# EasyEDA Pro project 手柄PCB工程.epro

# Board PCB1_1
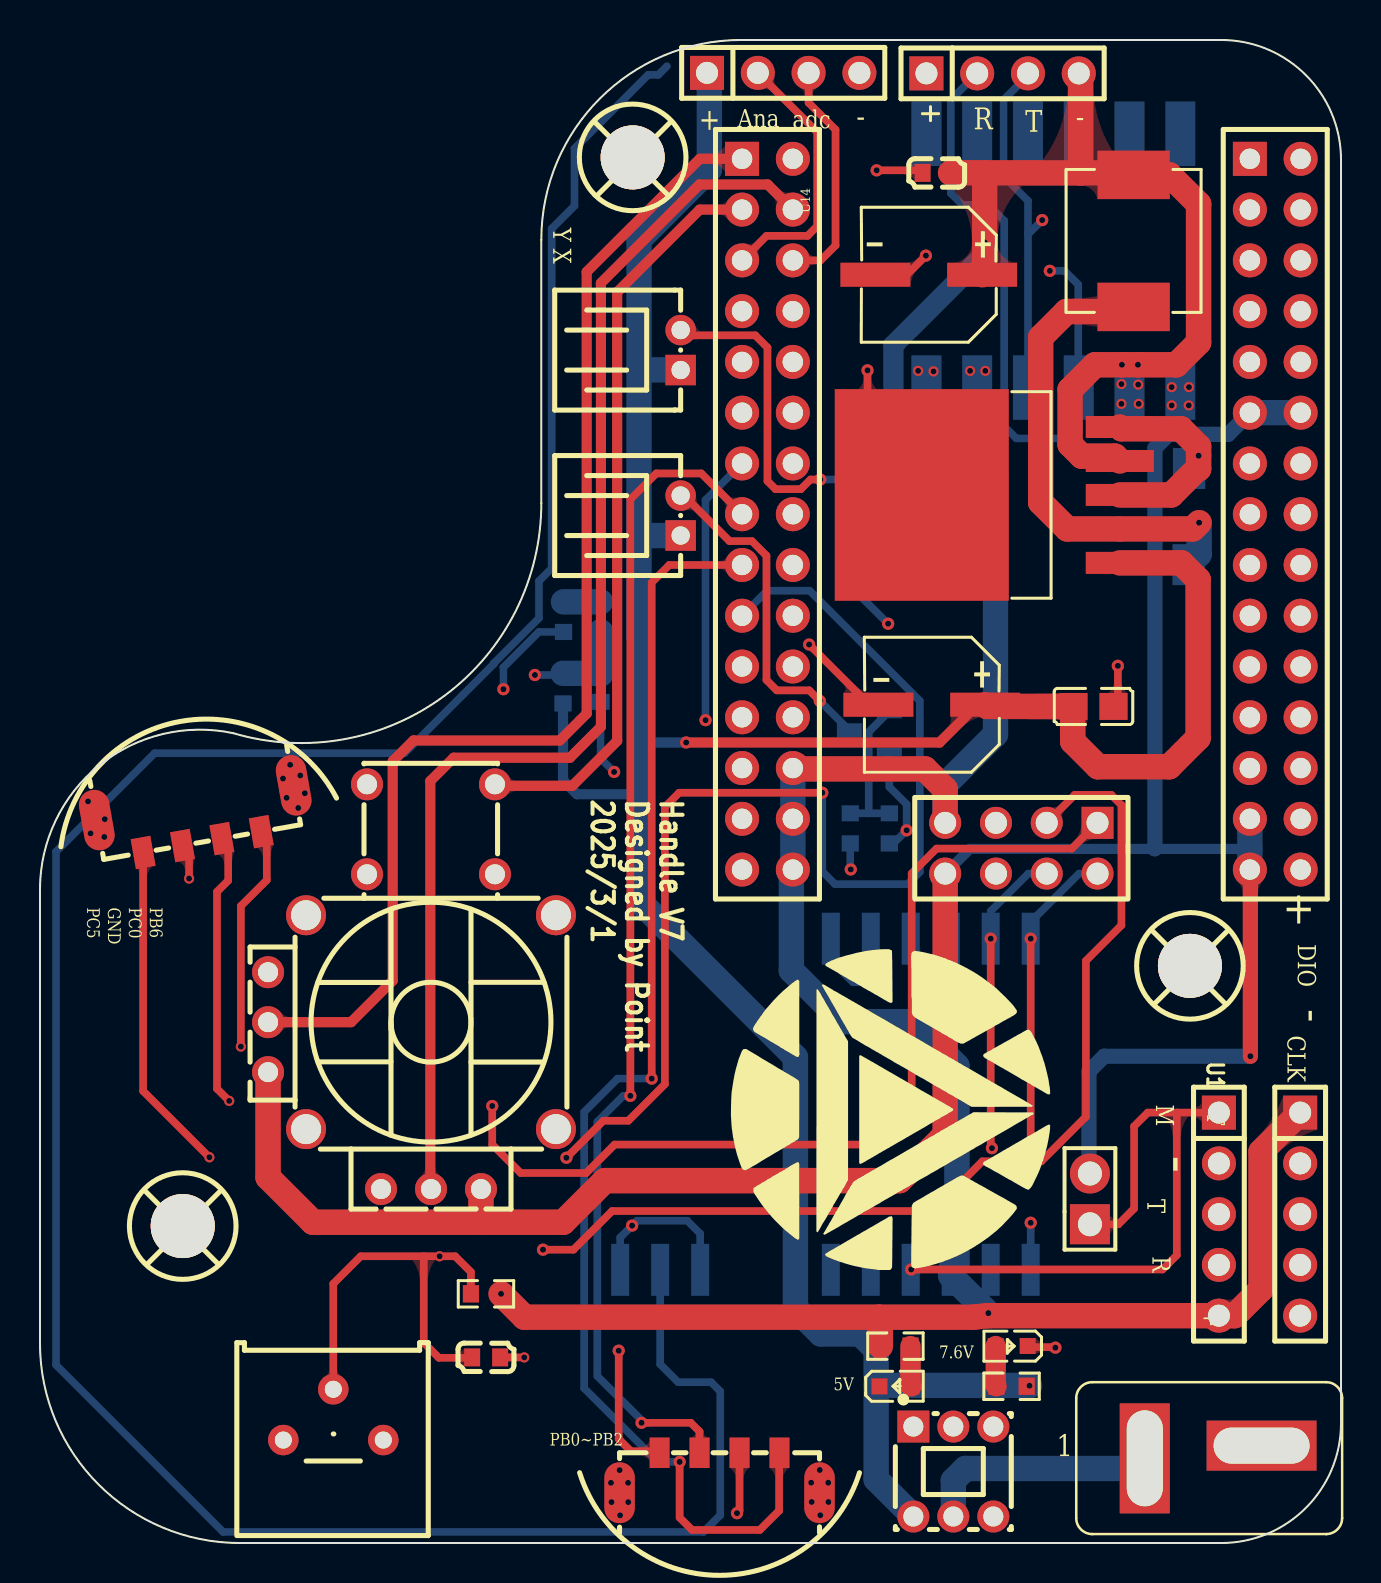
[diagram p0: board, top side]
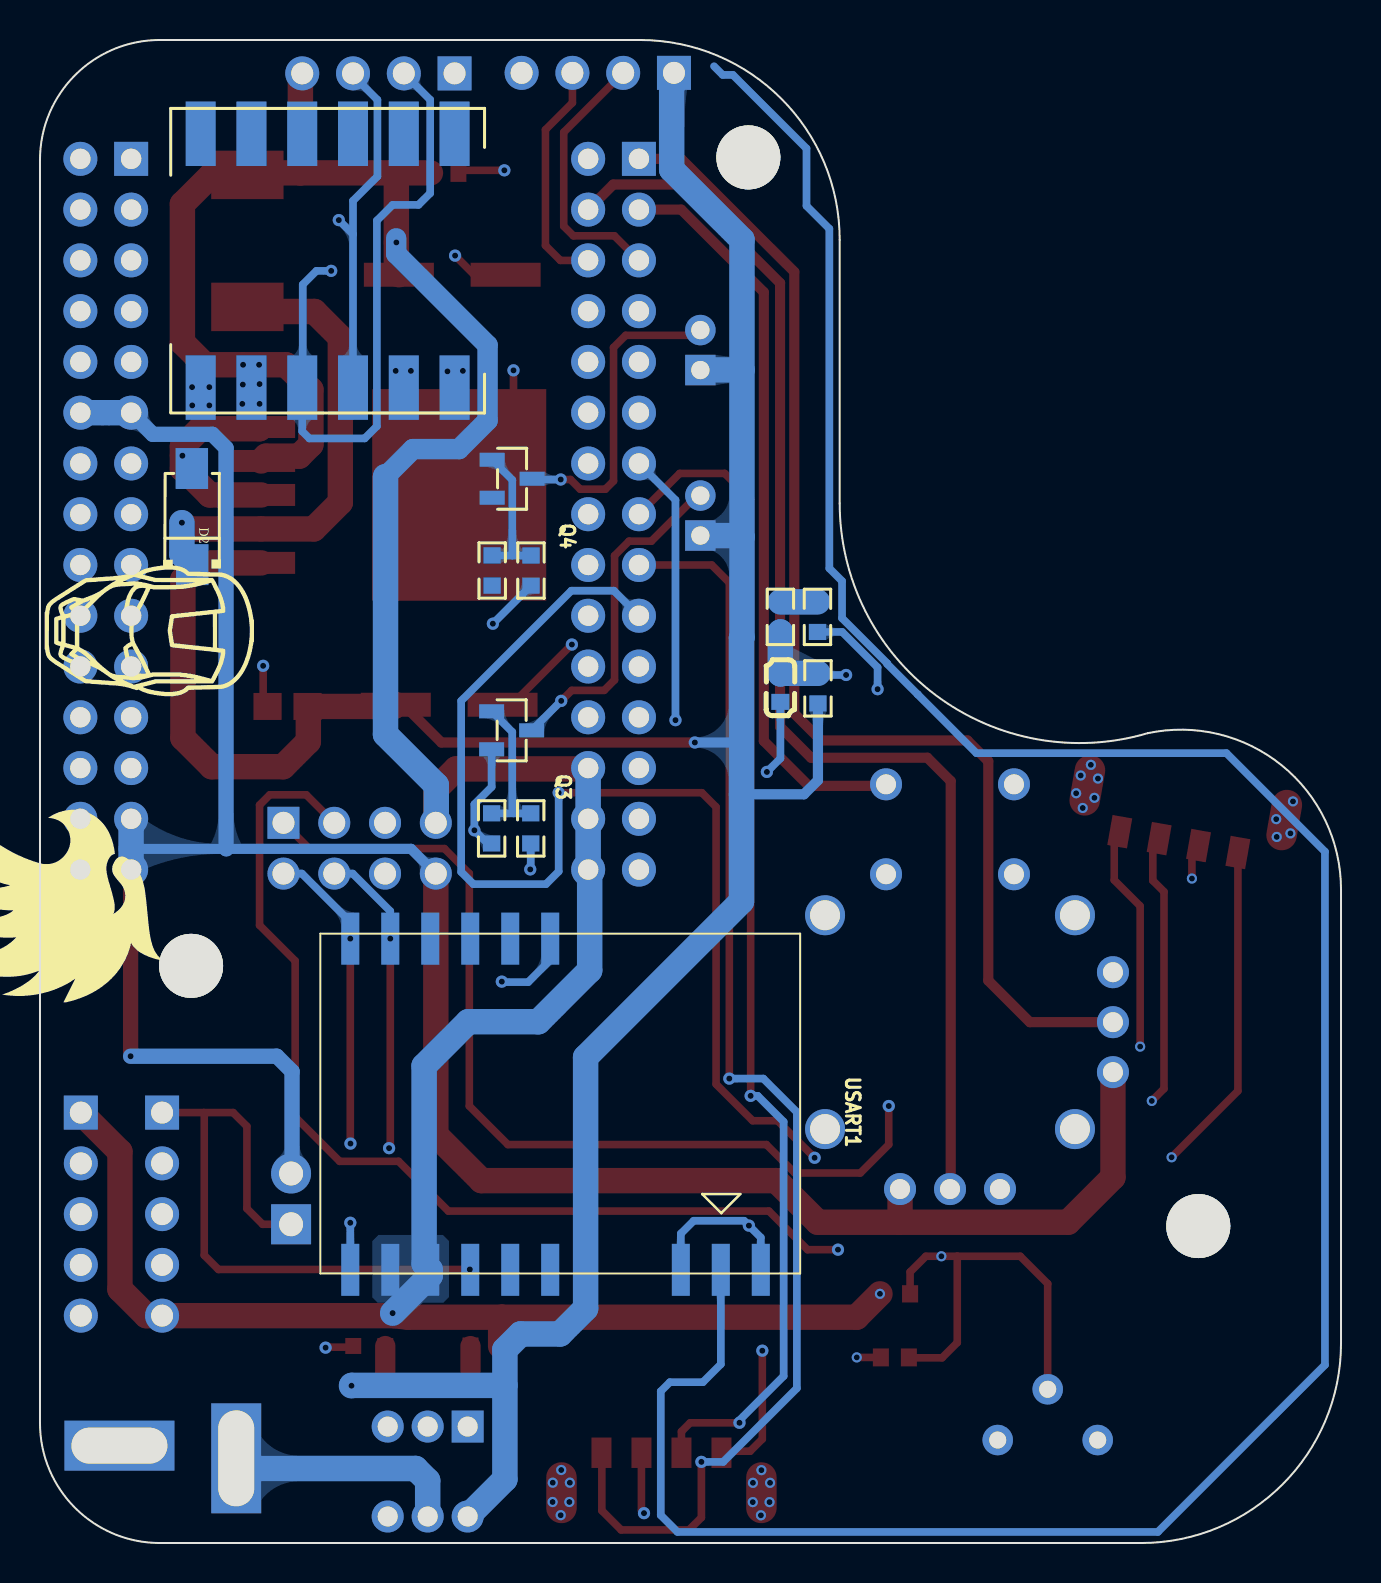
[diagram p1: board, bottom side, seen from below]

Outline 65.08 x 75.2 mm; copper layers: Top Layer, Inner1, Inner2, Bottom Layer. Coordinates in mm from the lower left corner of the outline.
Outline path: 0,32.69 arc(2.97,38.91) 9.67,40.52 arc(20.26,42.41) 25.08,52.02 25.08,65.2 arc(28,72.27) 35.08,75.2 59.08,75.2 arc(63.32,73.44) 65.08,69.2 65.08,6 arc(63.32,1.76) 59.08,0 10,0 arc(2.93,2.93) 0,10 0,32.69
Stack: Top Layer 0.035mm 外层铜厚1oz / Dielectric1 0.2104mm 7628 RC49% 8.6mil / Inner1 0.0152mm 内层铜厚 / Dielectric2 1.065mm 1.1mm H/HOZ 含铜 / Inner2 0.0152mm 内层铜厚 / Dielectric3 0.2104mm 7628 RC49% 8.6mil / Bottom Layer 0.035mm 外层铜厚1oz

## Design rules (mm)
template: JLCPCB Capability(Two Layers Board)
spacing copperThickness1oz (default): track to track 0.102, other pairs 0.152 to 0.3
spacing copperThickness2oz: track to track 0.203, other pairs 0.152 to 0.3
track width copperThickness1oz (default): min 0.127, default 0.254, max 2.54
track width copperThickness2oz: min 0.203, default 0.254, max 2.54
differential pair differentialPair (default): width min 0.127, default 0.254, max 2.54; gap min 0.152, default 0.152
via viaSize (default): diameter min 0.5, default 0.61, max 10; hole min 0.3, default 0.305, max 6.3

## Placement (name value [footprint] x y rotation side)
C23  220uF  [CAP-SMD_BD6.3-L6.6-W6.6-FD]  44.46 63.45 180 top
C24  100nF  [C0603]  44.85 68.55 180 top
C26  100nF  [C0805]  52.7 41.85 180 top
C27  220uF  [CAP-SMD_BD6.3-L6.6-W6.6-LS7.6-RD]  44.61 41.94 180 top
C28  100nF  [C0603]  28.04 42.78 270 bottom
C29  100nF  [C0603]  22.32 9.29 0 top
D2  SS54  [SMA_L4.3-W2.6-LS5.0-RD]  57.47 51.35 90 bottom
H38  -  [T插公头]  57.8 4.24 270 top
H50  USART1  [HDR-TH_8P-P2.54-V-F-R2-C4-S2.54]  49.09 34.76 180 top
H56  KH-2.54PH180-1X5P-L11.5  [HDR-TH_5P-P2.54-V-M]  58.97 16.45 270 top
H57  PZ254V-11-05P  [HDR-TH_5P-P2.54-V-M]  63.03 16.45 270 top
H58  PZ254V-11-02P  [HDR-TH_2P-P2.54-V-M]  52.52 17.22 90 top
H60  PZ254V-11-04P  [HDR-TH_4P-P2.54-V-M]  48.15 73.53 0 top
L4  33uH  [IND-SMD_L7.0-W6.6_FXL0630]  54.7 65.15 90 top
LED2  -  [LED_0603]  42.84 7.84 0 top
LED4  -  [LED_0603]  48.55 9.85 180 top
Q3  AO3400  [SOT-23-3_L2.9-W1.3-P1.90-LS2.4-BR]  41.48 40.66 0 bottom
Q4  AO3400  [SOT-23-3_L2.9-W1.3-P1.90-LS2.4-BR]  41.46 53.25 0 bottom
R7  2K  [R0603]  42.79 9.85 0 top
R10  100kΩ  [R0603]  26.16 42.76 90 bottom
R11  75kΩ  [R0603]  28.04 46.33 90 bottom
R12  2kΩ  [R0603]  26.19 46.33 270 bottom
R15  1kΩ  [R0603]  40.52 48.65 90 bottom
R16  10kΩ  [R0603]  42.46 48.66 90 bottom
R17  1kΩ  [R0603]  40.53 35.75 90 bottom
R18  10kΩ  [R0603]  42.48 35.75 90 bottom
R21  1kΩ  [R0603]  48.6 7.84 180 top
R24  5.1kΩ  [R0603]  22.31 12.47 180 top
R25  10kΩ  [RES-ADJ-TH_3P-L9.5-W9.5-P2.50-L_3386P]  14.67 6.42 180 top
RJ1  高巨摇杆电位器3D13A1N-T-386  [RES-ADJ-TH_3D13A1N-T-386]  18.61 27.83 270 top
SCREW1  -  [M3螺丝]  29.71 69.26 0 top
SCREW2  -  [M3螺丝]  7.2 15.79 0 top
SCREW3  -  [M3螺丝]  57.58 28.81 0 top
SW1  TK-6580D-1  [SW-TH_TK-6580D-1]  45.68 3.58 90 top
U8  LM2596S-5.0/TR  [TO-263-5_L10.2-W8.6-P1.70-LS14.4-TL]  49.06 52.44 180 top
U14  左  [HDR-TH_30P-P2.54-V-F-R2-C15-S2.54-2]  36.39 51.47 270 top
U15  右  [HDR-TH_30P-P2.54-V-F-R2-C15-S2.54-2]  61.79 51.47 270 top
U23  WAFER-PH2.0-2PWZ  [CONN-TH_2P-P2.00_GP01-2001WR-2P]  32.05 51.41 90 top
U24  WAFER-PH2.0-2PWZ  [CONN-TH_2P-P2.00_GP01-2001WR-2P]  32.05 59.69 90 top
U26  -  [四PinU型按键]  34.99 4.52 180 top
U27  JY901S  [jy901s]  50.69 64.16 90 bottom
U28  -  [四PinU型按键]  7.13 34.9 10 top
USART1  -  [ATK-LORA]  40.55 21.66 180 bottom
USART3  PZ254V-11-04P  [HDR-TH_4P-P2.54-V-M]  37.18 73.55 0 top

## Footprints (pads in the part's own frame, mm; a bottom-side part is the same pattern mirrored in y, then rotated)
ATK-LORA
  rect 0.9x2.6 smd: 1(11.532,-7.992) 2(9.532,-7.992) 3(7.532,-7.992) 4(0.999,-7.992) 5(-1.001,-7.992) 6(-3.001,-7.992) 7(-5.001,-7.992) 8(-7.001,-7.992) 9(-9.001,-7.992) 10(-9.001,8.576) 11(-7.001,8.576) 12(-5.001,8.576) 13(-3.001,8.576) 14(-1.001,8.576) 15(0.999,8.576)
C0603
  rect 0.8x0.9 smd: 1(-0.7,0) 2(0.7,0)
C0805
  rect 1.41x1.35 smd: 1(-1,0) 2(1,0)
CAP-SMD_BD6.3-L6.6-W6.6-FD
  rect 3.5x1.2 smd: 1(-2.67,0) 2(2.67,0)
CAP-SMD_BD6.3-L6.6-W6.6-LS7.6-RD
  rect 3.5x1.2 smd: 1(-2.67,0) 2(2.67,0)
CONN-TH_2P-P2.00_GP01-2001WR-2P
  rect 1.524x1.524 hole 0.914: 1(-1,0)
  round 1.524 hole 0.914: 2(1,0)
HDR-TH_2P-P2.54-V-M
  rect 2x2 hole 1.2: 1(-1.27,0)
  round 2 hole 1.2: 2(1.27,0)
HDR-TH_4P-P2.54-V-M
  rect 1.7x1.7 hole 1.1: 1(-3.81,0)
  round 1.7 hole 1.1: 2(-1.27,0) 3(1.27,0) 4(3.81,0)
HDR-TH_5P-P2.54-V-M
  rect 1.7x1.7 hole 1.1: 1(-5.08,0)
  round 1.7 hole 1.1: 2(-2.54,0) 3(0,0) 4(2.54,0) 5(5.08,0)
HDR-TH_8P-P2.54-V-F-R2-C4-S2.54
  rect 1.6x1.6 hole 1.1: 1(-3.81,-1.27)
  round 1.6 hole 1.1: 2(-3.81,1.27) 3(-1.27,-1.27) 4(-1.27,1.27) 5(1.27,-1.27) 6(1.27,1.27) 7(3.81,-1.27) 8(3.81,1.27)
HDR-TH_30P-P2.54-V-F-R2-C15-S2.54-2
  rect 1.7x1.7 hole 1.02: 1(-17.78,-1.27)
  round 1.7 hole 1.02: 2(-17.78,1.27) 3(-15.24,-1.27) 4(-15.24,1.27) 5(-12.7,-1.27) 6(-12.7,1.27) 7(-10.16,-1.27) 8(-10.16,1.27) 9(-7.62,-1.27) 10(-7.62,1.27) 11(-5.08,-1.27) 12(-5.08,1.27) 13(-2.54,-1.27) 14(-2.54,1.27) 15(0,-1.27) 16(0,1.27) 17(2.54,-1.27) 18(2.54,1.27) 19(5.08,-1.27) 20(5.08,1.27) 21(7.62,-1.27) 22(7.62,1.27) 23(10.16,-1.27) 24(10.16,1.27) 25(12.7,-1.27) 26(12.7,1.27) 27(15.24,-1.27) 28(15.24,1.27) 29(17.78,-1.27) 30(17.78,1.27)
IND-SMD_L7.0-W6.6_FXL0630
  rect 2.424x3.62 smd: 1(3.302,0) 2(-3.302,0)
jy901s
  rect 3.224x1.501 smd: 1(-6.35,6.35) 2(-6.35,3.81) 3(-6.35,1.27) 4(-6.35,-1.27) 5(-6.35,-3.81) 6(-6.35,-6.35) 7(6.35,-6.35) 8(6.35,-3.81) 9(6.35,-1.27) 10(6.35,1.27) 11(6.35,3.81) 12(6.35,6.35)
LED_0603
  rect 0.8x0.8 smd: 1(-0.851,-0.01) 2(0.75,-0.005)
M3螺丝
  round 3.2 hole 3.2: 1(-0.064,0.064)
R0603
  rect 0.806x0.864 smd: 1(-0.753,0) 2(0.753,0)
RES-ADJ-TH_3D13A1N-T-386
  round 2 hole 1.5: 0(-3.575,7.2) 0(-3.575,-5.3) 0(7.125,7.2) 0(7.125,-5.3)
  round 1.6 hole 1: 1(10.125,3.45) 2(10.125,0.95) 3(10.125,-1.55) 4(4.275,-7.2) 5(1.775,-7.2) 6(-0.725,-7.2) 7(-10.125,4.15) 8(-10.125,-2.25) 9(-5.625,4.15) 10(-5.625,-2.25)
RES-ADJ-TH_3P-L9.5-W9.5-P2.50-L_3386P
  round 1.524 hole 0.85: 1(-2.5,1.27) 2(0,-1.27) 3(2.5,1.27)
SMA_L4.3-W2.6-LS5.0-RD
  rect 2.046x1.62 smd: 1(-2.404,-0.009) 2(2.404,0.009)
SOT-23-3_L2.9-W1.3-P1.90-LS2.4-BR
  rect 1.25x0.7 smd: 1(1,-0.95) 2(1,0.95) 3(-1,0)
SW-TH_TK-6580D-1
  rect 1.6x1.6 hole 1: 1(2.25,2)
  round 1.6 hole 1: 2(2.25,0) 3(2.25,-2) 4(-2.25,2) 5(-2.25,0) 6(-2.25,-2)
TO-263-5_L10.2-W8.6-P1.70-LS14.4-TL
  rect 3.4x1.1 smd: 1(-4.953,3.4) 2(-4.953,1.7) 3(-4.953,0) 4(-4.953,-1.7) 5(-4.953,-3.4)
  rect 8.705x10.587 smd: 6(4.953,0)
T插公头
  rect 2.5x5.5 hole 1.8x4.8: 1(-0.635,3.302)
  rect 5.5x2.5 hole 4.8x1.8: 2(0,-2.54)
四PinU型按键
  rect 1x1.524 smd: 1(-2,0) 2(0,0) 3(2,0) 4(4,0)
  oval 1.524x3.048 smd: 5(-4,2) 6(6,2)

## Nets
3V3: H50.8 H58.2 RJ1.1 RJ1.4 U15.11 U15.12 U15.27 U15.29
5V: C23.1 C24.1 H50.7 H56.5 H57.1 H60.4 L4.1 R7.1 R24.1 U8.4 U14.26 U14.28 U14.30 U27.2 USART1.7 USART1.8
7.6V: C26.2 C27.1 R10.1 R21.1 SW1.4 U8.1 U23.1 U24.1 USART3.1
+7.6V: H38.2 SW1.5
GND: C23.2 C24.2 C26.1 C27.2 C28.2 C29.2 H38.1 H50.5 H56.2 H57.4 H60.1 LED2.1 LED4.1 Q3.2 Q4.2 R12.2 R16.1 R18.1 R25.3 RJ1.3 RJ1.6 RJ1.9 U8.6 U14.25 U14.27 U14.29 U15.13 U15.14 U15.26 U15.28 U15.30 U26.2 U27.5 U28.2 USART1.1 USART1.3 USART1.9 USART1.15 USART3.4
BAT: U15.25
BOOT: U15.3
CLK: H50.1 H57.5
DIO: H50.3 H57.3
MDO: H56.1 H58.1 USART1.6
PA0: U14.6 USART3.3
PA1: U14.5 USART3.2
PA2: H60.2 U14.8 U27.3
PA3: H60.3 U14.7 U27.4
PA4: U14.10
PA5: U14.12
PA6: U14.14
PA7: U14.16
PA8: U15.17
PA11: U15.20
PA12: U15.19
PA15: U15.18
PB0: U14.13 U26.4
PB1: U14.15 U26.3
PB2: U14.17 U26.1
PB3: U15.8
PB4: U15.7
PB5: U15.6
PB6: U15.5 U28.4
PB7: U15.4
PB9: U15.2
PB10: U14.19
PB11: C29.1 R24.2 R25.2 U14.20
PB12: C28.1 R10.2 R11.1 U14.21
PB13: U14.22
PB14: U14.23
PB15: U14.24
PC0: U14.2 U28.3
PC1: RJ1.5 U14.1
PC2: RJ1.2 U14.4
PC3: RJ1.7 U14.3
PC4: U14.18
PC5: U14.11 U28.1
PC6: U15.23
PC7: U15.24
PC8: R15.1 U15.21
PC9: R17.1 U15.22
PC10: U15.16
PC11: U15.15
PC12: U15.10
PC13: U15.1
PD2: U15.9
RST: H50.6
RX_PA10: H50.4 H56.4 USART1.11
TX_PA9: H50.2 H56.3 USART1.10
VREF: U14.9
$1N385: D2.2 U8.3 U8.5
$1N386: D2.1 L4.2 U8.2
$1N392: LED2.2 R7.2
$1N13221: R11.2 R12.1
$1N31586: Q4.1 R15.2 R16.2
$1N32984: Q3.1 R17.2 R18.2
$1N36354: LED4.2 R21.2
$1N39133: Q3.3 U23.2
$1N39187: Q4.3 U24.2

Pads without a net: H57 2; R25 1; RJ1 0 8 10; SCREW1 1; SCREW2 1; SCREW3 1; SW1 1 2 3 6; U26 5 6; U27 1 6 7 8 9 10 11 12; U28 5 6; USART1 2 4 5 12 13 14

## Via types
v1: diameter 0.508, hole 0.3, Top Layer to Bottom Layer, 45 vias
v2: diameter 0.61, hole 0.305, Top Layer to Bottom Layer, 40 vias

## Routing (per net, layer and track width the routed paths; a pad name or vN(x,y) marks a point on that pad's centre or on a via; arc(x,y) is an arc through that point)
3V3: length 125.9
  Top Layer w0.762: v2(60.54,24.35) 60.54,33.67 U15.29
  Top Layer w1.27: RJ1.1 22.06,16.09 22.1,16.05 ; 22.1,16.05 26.17,16.05 28.25,18.13 42.99,18.13 45.28,20.42 H50.8 ; 22.1,16.05 13.65,16.05 11.41,18.3 RJ1.4
  Bottom Layer w0.508: H50.8 46.51,34.73 60.52,34.73
  Bottom Layer w0.762: v2(60.54,24.35) 53.23,24.35 52.47,23.59 52.47,18.54 H58.2 ; U15.11 59.43,55.47 56.45,55.47 55.77,54.78 55.77,34.74 55.75,34.73
  Bottom Layer w1.27: 60.52,36.23 U15.29 ; U15.11 U15.12
5V: length 172.4
  Top Layer w1.27: H60.4 52.05,73.44 52.05,68.55 ; 47.25,68.55 v1(47.25,65.07) 47.25,63.89 47.13,63.77 C23.1 ; 47.25,68.55 C24.1 ; 47.25,68.55 52.05,68.55 ; H57.1 61.08,19.58 61.08,12.7 59.76,11.38 H56.5 47.38,11.38 46.67,11.3 41.97,11.3 ; U14.26 37.7,38.73 44.26,38.73 45.28,37.72 H50.7 ; R7.1 42.04,11.23 41.97,11.3 ; 54.01,54.14 53.77,54.38 52.11,54.38 51.52,54.96 51.52,57.7 52.77,58.95 v1(54.12,58.95) v1(54.92,58.95) 56.83,58.95 57.95,60.07 57.95,66.99 56.5,68.45 L4.1 54.6,68.55 52.05,68.55 ; 41.97,11.3 24.23,11.3 v1(23.06,12.47)
  Bottom Layer w1.016: 47.79,53.36 46.42,54.73 44.12,54.73 42.69,56.16 42.69,59.93 47.26,64.5 47.26,65.27
  Bottom Layer w1.27: v2(47.44,11.5) 45.55,13.38 USART1.7 45.86,13.98 45.86,23.87 43.65,26.08 40.15,26.08 37.58,28.65 37.58,33.62 U14.30 U14.26 ; H50.7 45.25,36.06 45.25,37.92 47.79,40.46 47.79,53.36
  vias: v1(54.09,57.98) v1(54.09,56.99) v1(54.93,57.96) v1(54.96,56.99)
7.6V: length 143.6
  Top Layer w0.508: 46.85,41.91 45,40.05 v2(32.32,40.05)
  Top Layer w1.27: U8.1 57.1,49.04 57.93,48.2 57.93,40.28 56.49,38.84 52.92,38.84 51.65,40.1 51.65,41.81 C26.2 47.36,41.85 C27.1
  Bottom Layer w0.508: 29.99,37.44 29.96,37.46 26.86,37.46 26.16,38.16 R10.1 ; v2(32.32,40.05) 29.99,40.05
  Bottom Layer w1.27: 29.96,50.34 29.96,45.31 29.99,45.29 29.99,32.1 37.78,24.3 37.78,11.73 39.06,10.46 41.04,10.46 41.82,9.67 41.82,7.89 ; 29.96,50.34 29.96,58.69 ; 29.96,50.34 30.03,50.41 32.02,50.41 ; 29.96,58.69 29.96,65.2 33.48,68.72 33.48,72.93 33.37,73.05 USART3.1 ; 29.96,58.69 32.04,58.69 U24.1 ; 43.55,1.46 41.82,3.19 41.82,7.89 ; 41.82,7.89 49.48,7.89 v1(49.49,7.87)
+7.6V: length 11.8
  Bottom Layer w1.27: SW1.5 45.68,3.12 46.29,3.73 54.75,3.73 H38.2
GND: length 55.5
  Top Layer w0.381: LED4.1 49.46,9.8 50.76,9.8 v2(50.79,9.77) ; C26.1 53.91,42.07 v2(53.91,43.89) ; C24.2 44.02,68.68 v2(41.85,68.68) ; C27.2 41.48,41.94 v2(38.47,44.95) ; U8.6 41.39,55.15 v2(41.39,58.67) ; v2(34.86,1.49) 34.99,1.62 U26.2 ; U28.2 7.46,34.56 v1(7.46,33.24) ; C23.2 43.36,63.45 v2(44.31,64.41) ; C29.2 v1(24.22,9.29)
  Bottom Layer w0.381: R18.1 42.69,35 v2(43.35,35.66) 43.35,36.96 42.48,37.83 Q3.2 ; v2(41.98,28.09) 41.95,28.06 40.66,28.06 39.55,29.16 USART1.15 ; USART1.9 v2(49.55,16.02) ; C28.2 28.04,39.25 v2(28.72,38.58) ; USART1.3 33.02,15.48 32.37,16.12 29.86,16.12 v2(29.62,15.88) 29.02,15.29 USART1.1 ; R12.2 24.95,45.58 23.18,43.81 v2(23.18,42.72)
  vias: v1(46.52,58.64) v1(47.28,58.64)
(no net): length 136.8
  Bottom Layer w0.381: 31.36,73.88 30.93,73.45 30.42,73.45 26.74,69.77 26.74,66.9 25.59,65.76 25.59,48.76 24.96,48.13 24.96,46.27 22.7,44.01 22.7,43.98 21.17,42.46 ; 21.17,42.46 18.23,39.52 5.73,39.52 0.8,34.59 0.8,8.91 9.16,0.55 33.19,0.55 34.03,1.39 34.03,7.59 33.57,8.05 31.92,8.05 31.02,8.94 USART1.2 ; 21.17,42.46 21.17,42.46
  vias: v1(2.4,37.1) v1(2.53,35.5) v1(3.24,36.22) v1(3.22,35.33) v1(12.16,38.25) v1(12.33,37.28) v1(12.51,38.93) v1(12.92,36.77) v1(13.02,38.4) v1(13.25,37.51) v1(28.56,3.01) v1(28.58,2.05) v1(28.99,3.65) v1(29.02,1.39) v1(29.41,3.01) v1(29.42,2.05) v1(38.57,3.02) v1(38.6,2.05) v1(39,3.65) v1(39.03,1.39) v1(39.43,3.02) v1(39.44,2.05) v1(43.92,58.64) v1(44.69,58.62) v1(56.61,57.83) v1(56.61,56.92) v1(57.47,57.83) v1(57.46,56.92)
CLK: length 81.7
  Top Layer w0.381: H50.1 51.61,34.74 44.85,34.74 43.6,33.5 43.6,21.86 41.67,19.93 28.74,19.93 27.32,18.51 24.04,18.51 22.62,19.93 v2(22.62,21.86)
  Inner1 w0.381: H50.1 54.32,34.61 54.32,26.36 54.98,25.7 63.24,25.7 64.43,24.51 64.43,12.77 H57.5
DIO: length 80.4
  Top Layer w0.381: H50.3 51.76,37.44 53.58,37.44 54.09,36.92 54.09,30.91 52.31,29.13 52.31,21.33 50.08,19.1 47.14,19.1 44.65,16.61 28.62,16.61 26.69,14.68 v2(25.16,14.68)
  Inner1 w0.381: H57.3 63.01,16.48 61.1,16.48 60.34,17.24 60.34,22.88 59.05,24.18 52.8,24.18 51.63,25.34 51.63,34.76 H50.3
MDO: length 32.3
  Top Layer w0.381: H58.1 53.94,15.95 54.73,16.73 54.73,20.85 55.41,21.53 56.88,21.53 ; 56.88,21.53 H56.1 58.69,21.26 ; 56.88,21.53 56.86,21.51 56.86,14.4 56.15,13.69 v2(43.58,13.69)
  Bottom Layer w0.381: v2(43.58,13.69) 43.56,13.67 USART1.6
PA0: length 11.6
  Top Layer w0.381: 37.66,64.17 39.05,64.17 39.79,64.92 39.79,70.71 38.45,72.06 USART3.3
PA1: length 13.4
  Top Layer w0.381: USART3.2 38.88,70.58 38.88,65.88 38.39,65.4 36.35,65.4 35.12,64.17
PA2: length 46.9
  Inner1 w0.381: v2(50.51,63.65) 48.49,61.63 U14.8
  Bottom Layer w0.381: H60.2 45.56,72.21 45.56,67.53 46.14,66.95 47.44,66.95 48.22,66.16 48.22,55.88 48.83,55.27 51.6,55.27 51.96,55.62 U27.3 51.93,57.83 51.93,62.96 51.25,63.65 v2(50.51,63.65)
PA3: length 34.4
  Inner1 w0.381: v2(50.13,66.19) 46.83,62.89 36.37,62.89 35.12,61.63
  Bottom Layer w0.381: 48.94,73.33 49.13,73.14 48.2,72.21 48.2,68.37 49.42,67.15 49.42,65.48 ; U27.4 49.42,65.48 ; 49.42,65.48 v2(50.13,66.19)
PB0: length 54
  Top Layer w0.381: U26.4 30.92,4.59 29.56,4.59 28.95,5.2 v2(28.95,9.62)
  Inner1 w0.381: v2(33.29,41.17) 33.29,22.22 28.56,17.5 28.56,10 v2(28.95,9.62)
  Bottom Layer w0.381: v2(33.29,41.17) 33.29,52.18 35.12,54.01
PB1: length 59.1
  Top Layer w0.381: v2(29.53,22.37) 29.53,52.22 30.83,53.51 33.08,53.51 35.12,51.47 ; U26.3 32.99,5.58 32.55,6.02 v2(30.09,6.02)
  Bottom Layer w0.381: v2(29.53,22.37) 29.17,22.37 27.88,21.08 27.88,8.35 30.09,6.14 v2(30.09,6.02)
PB2: length 65.2
  Top Layer w0.381: v2(31.99,4.06) 31.99,1.27 32.61,0.66 36.01,0.66 36.97,1.62 36.97,4.5 U26.1 ; v2(30.6,23.24) 30.6,48.05 31.48,48.93 35.12,48.93
  Bottom Layer w0.381: v2(30.6,23.24) 28.89,23.24 27.22,21.56 27.22,7.74 30.9,4.06 v2(31.99,4.06)
PB6: length 99.6
  Top Layer w0.381: U28.4 11.34,35.31 11.34,33.17 10.05,31.87 v1(10.05,24.84)
  Inner1 w0.381: 60.52,64.17 53.73,70.96 34.33,70.96 26.66,63.29 26.66,47.9 17.5,38.74 17.5,27.11 15.23,24.84 v1(10.05,24.84)
PB10: length 58.1
  Top Layer w0.381: v2(26.33,19.27) 28.18,21.13 29.43,21.13 31.26,22.96 31.26,36.83 31.97,37.54 v2(39.13,37.54)
  Bottom Layer w0.381: v2(39.13,37.54) 39.13,33.6 39.77,32.96 43.4,32.96 44.01,33.58 44.01,42.13 38.5,47.65 36.37,47.65 35.12,46.39
PB11: length 82.3
  Top Layer w0.381: C29.1 21.6,9.27 19.95,9.27 19.2,10.03 19.2,14.35 ; 19.2,14.35 v1(19.99,14.35) 20.77,14.35 21.55,13.56 R24.2 ; 19.2,14.35 16.04,14.35 14.67,12.97 14.67,7.69
  Inner1 w0.381: 19.98,14.35 19.98,8.71 20.95,7.74 35.4,7.74 36.46,8.81 36.46,44.35 37.66,45.54 37.66,46.39
PB12: length 17.2
  Inner1 w0.381: v2(24.75,43.43) 26.25,41.93 33.2,41.93 35.12,43.85
  Bottom Layer w0.381: R10.2 26.08,43.43 v2(24.75,43.43)
  Bottom Layer w1.27: R11.1 28.04,45.58 C28.1 28.01,43.51 R10.2
PC0: length 78.3
  Top Layer w0.381: v1(9.46,22.12) 8.85,22.73 8.85,32.58 9.41,33.14 9.41,34.93 U28.3
  Inner1 w0.381: 37.66,69.25 36.31,67.9 33.41,67.9 27.65,62.15 27.65,48.21 18.61,39.16 18.61,24.38 16.35,22.12 v1(9.46,22.12)
PC1: length 61
  Top Layer w0.508: 35.12,69.25 33,69.25 27.35,63.6 27.35,41.5 26,40.15 18.68,40.15 17.64,39.11 17.64,28.14 15.56,26.06 RJ1.5
PC2: length 64.4
  Top Layer w0.508: RJ1.2 19.52,17.74 19.52,38.12 20.69,39.29 26.51,39.29 28.06,40.84 28.06,63.04 32.99,67.97 36.4,67.97 U14.4
PC3: length 37.3
  Top Layer w0.508: 35.12,66.71 33,66.71 28.87,62.58 28.87,40.13 26.62,37.88 22.96,37.88
PC5: length 73.4
  Top Layer w0.381: U28.1 5.16,22.62 v1(8.47,19.3)
  Inner1 w0.381: v1(8.47,19.3) 8.52,19.25 17.16,19.25 19.27,21.36 19.27,37.89 23.83,42.45 23.83,43.62 28.74,48.53 28.74,55.8 29.5,56.55 35.12,56.55
PC8: length 21.7
  Inner1 w0.381: U15.21 58.37,45.99 v2(42.42,45.99)
  Bottom Layer w0.381: v2(42.42,45.99) R15.1
PC9: length 34.9
  Inner1 w0.381: U15.22 64.35,42.56 64.35,38.23 63.68,37.56 41.49,37.56 40.55,36.62 v2(40.55,33.7)
  Bottom Layer w0.381: R17.1 40.53,33.73 v2(40.55,33.7)
RX_PA10: length 31.7
  Top Layer w0.381: v2(47.55,30.24) 47.55,19.82 v2(47.61,19.76)
  Inner1 w0.381: v2(47.61,19.76) 47.61,15.54 49.24,13.91 H56.4
  Bottom Layer w0.381: v2(47.55,30.24) 47.55,31.61 49.43,33.49 H50.4
TX_PA9: length 27.8
  Top Layer w0.381: v2(49.55,19.99) 49.55,19.99 v2(49.55,30.24)
  Inner1 w0.381: v2(49.55,19.99) 53.46,19.99 54.07,19.38 54.07,16.84 54.45,16.45 H56.3
  Bottom Layer w0.381: v2(49.55,30.24) 49.55,31.07 51.97,33.49 H50.2
$1N385: length 9.9
  Top Layer w1.27: 54.01,55.84 54.1,55.75 57.06,55.75 57.95,54.86 v2(57.95,54.4) 57.95,53.74 57.89,53.74 56.59,52.44 U8.3
$1N386: length 24.5
  Top Layer w1.27: v2(57.98,51.05) 57.67,50.74 U8.2 51.38,50.74 50.05,52.07 50.05,60.32 51.35,61.62 54.47,61.62 L4.2
  Bottom Layer w1.27: 57.46,48.95 57.98,49.47 v2(57.98,51.05)
$1N392: length 2
  Top Layer w1.016: LED2.2 43.54,7.89 R7.2
$1N13221: length 1.9
  Bottom Layer w1.27: R12.1 R11.2
$1N31586: length 7.2
  Bottom Layer w0.381: R16.2 42.46,49.41 41.45,49.41 ; 41.45,49.41 41.45,53.19 Q4.1 ; 41.45,49.41 R15.2
$1N32984: length 7.5
  Bottom Layer w0.381: Q3.1 41.45,40.58 41.45,36.56 41.4,36.51 ; 41.4,36.51 R18.2 ; 41.4,36.51 R17.2
$1N36354: length 2
  Top Layer w1.016: R21.2 47.81,7.88 LED4.2
$1N39133: length 17
  Top Layer w0.381: v2(39,42.13) 38.48,42.66 36.86,42.66 36.34,43.18 36.34,49.4 35.61,50.12 34.49,50.12 32.21,52.41 32.02,52.41
  Bottom Layer w0.381: v2(39,42.13) 40.48,40.66 40.48,40.66
$1N39187: length 15.8
  Top Layer w0.381: U24.2 32.31,60.42 35.78,60.42 36.39,59.81 36.39,53.13 36.79,52.73 38.06,52.73 38.54,53.21 v2(39.03,53.21)
  Bottom Layer w0.381: v2(39.03,53.21) 40.42,53.21 Q4.3

## Copper pours and planes (outline as drawn; the poured copper is in the pictures)
5V on Bottom Layer: 44.62,15.41 48.45,15.41 48.45,12.02 44.62,12.02
GND on Top Layer: 1.21,89.99 69.28,89.99 69.28,-18.95 1.21,-18.95
GND on Bottom Layer: -3.92,86.63 82.31,86.63 82.31,-15.73 -3.92,-15.73
GND on Inner2: -14.87,81.76 79.34,81.76 79.34,-11 -14.87,-11

Small or netless copper shapes (teardrops, artwork), in the pictures only: 82 on Top Layer, 82 on Bottom Layer, 25 on Inner1

## Text on the board
Top Silkscreen Layer: U1 | + | Handle V7 / Designed by Point / 2025/3/1 | PB0~PB2 | 5V | 7.6V | PB6 / PC0 / GND / PC5 | DIO | Ana | adc | Y X | T | R | M | CLK | - | 1

# Board PCB1
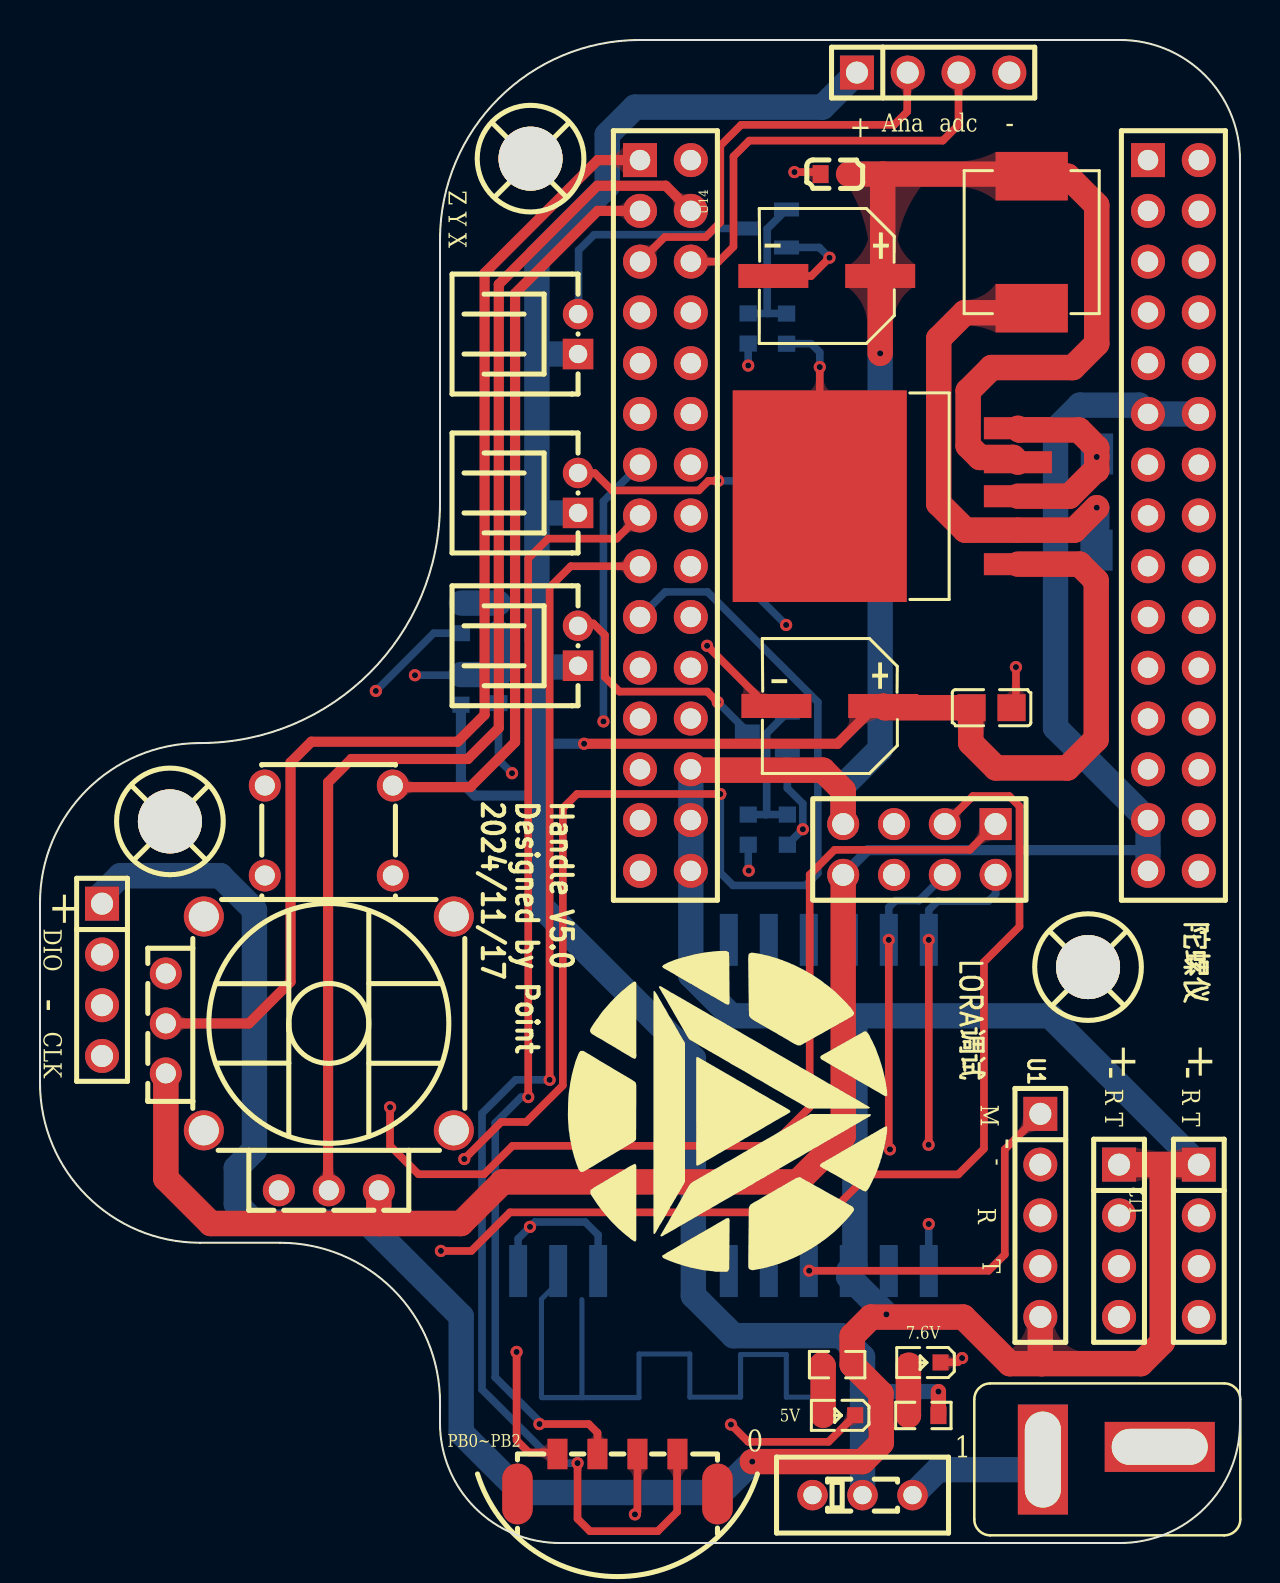
[diagram p2: board, top side]
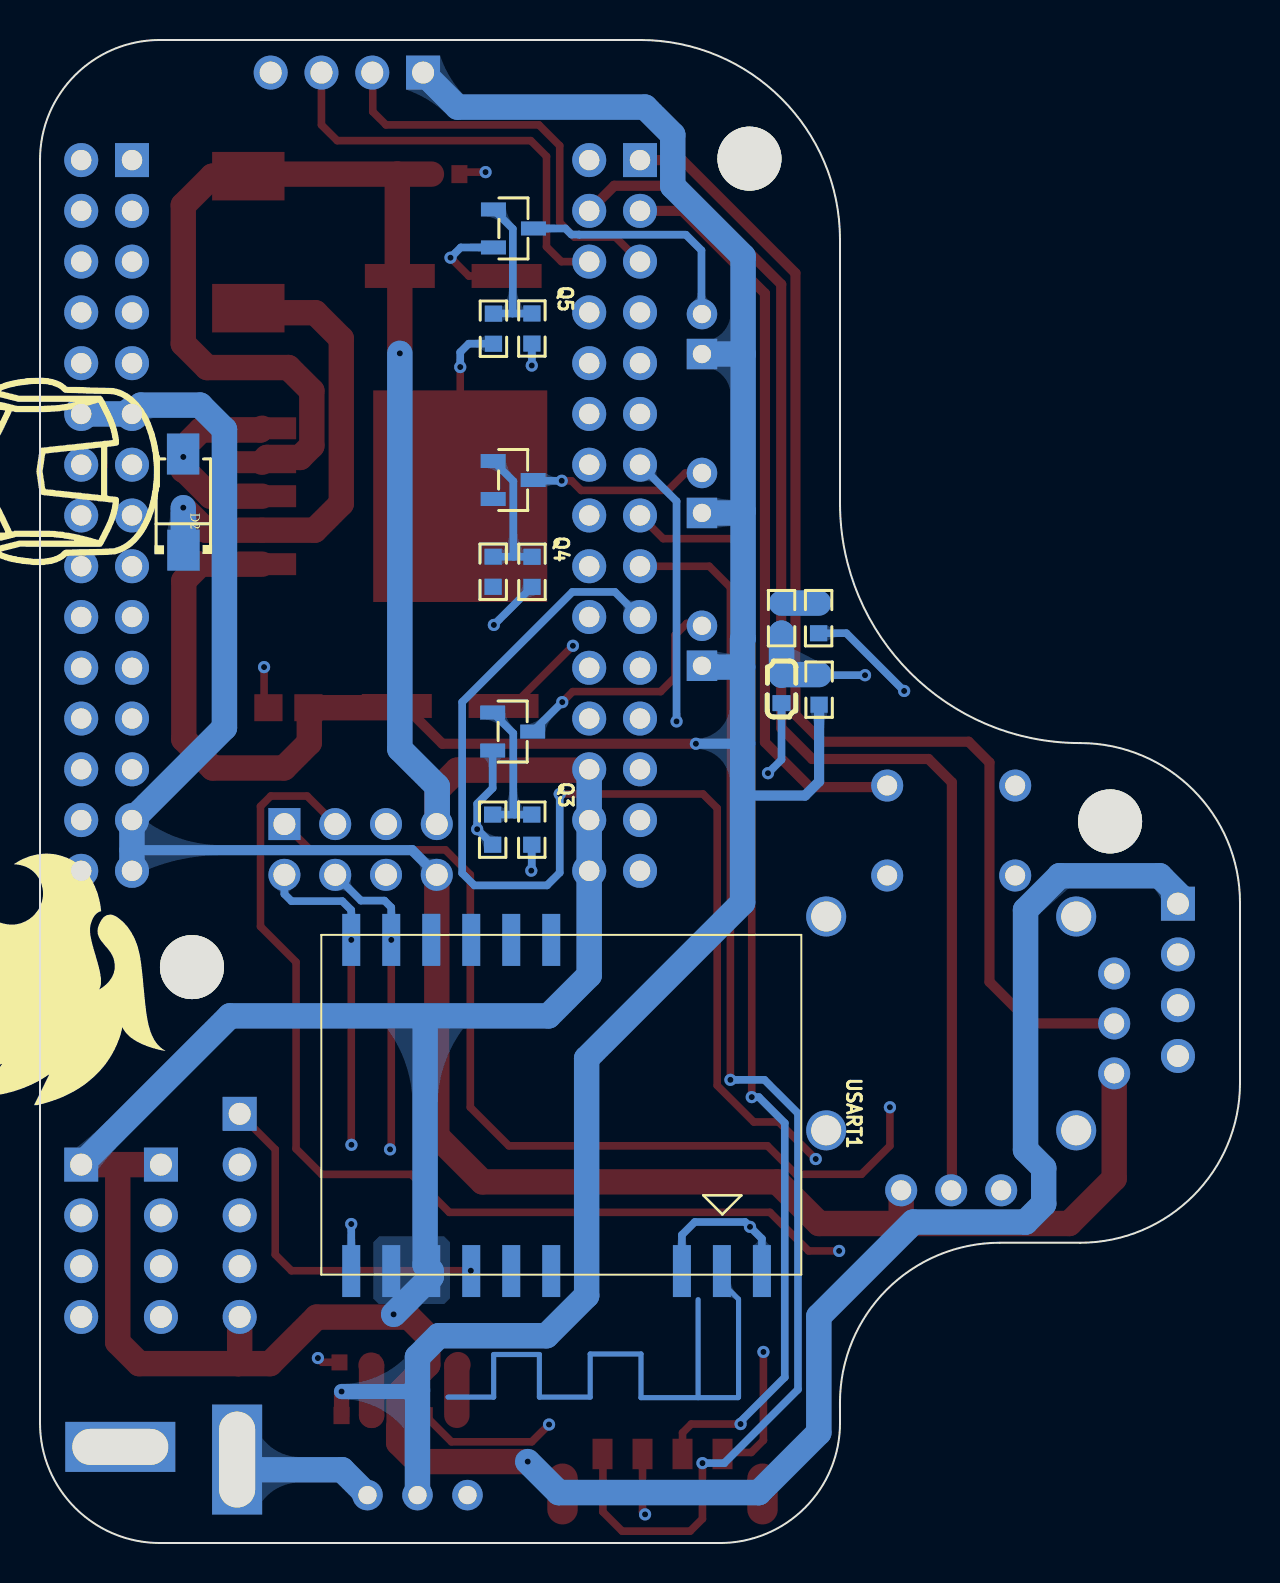
[diagram p3: board, bottom side, seen from below]

Outline 60 x 75.2 mm; copper layers: Top Layer, Inner1, Inner2, Bottom Layer. Coordinates in mm from the lower left corner of the outline.
Outline path: 0,32.02 arc(2.34,37.68) 8,40.02 arc(16.49,43.54) 20,52.02 20,65.2 arc(22.93,72.27) 30,75.2 54,75.2 arc(58.24,73.44) 60,69.2 60,6 arc(58.24,1.76) 54,0 26,0 arc(21.75,1.76) 20,6.01 20,7.01 arc(17.66,12.68) 12,15.02 8,15.02 arc(2.34,17.37) 0,23.02 0,32.02
Stack: Top Layer 0.035mm 外层铜厚1oz / Dielectric1 0.2104mm 7628 RC49% 8.6mil / Inner1 0.0152mm 内层铜厚 / Dielectric2 1.065mm 1.1mm H/HOZ 含铜 / Inner2 0.0152mm 内层铜厚 / Dielectric3 0.2104mm 7628 RC49% 8.6mil / Bottom Layer 0.035mm 外层铜厚1oz

## Design rules (mm)
template: JLCPCB Capability(Two Layers Board)
spacing copperThickness1oz (default): track to track 0.102, other pairs 0.152 to 0.3
spacing copperThickness2oz: track to track 0.203, other pairs 0.152 to 0.3
track width copperThickness1oz (default): min 0.127, default 0.254, max 2.54
track width copperThickness2oz: min 0.203, default 0.254, max 2.54
differential pair differentialPair (default): width min 0.127, default 0.254, max 2.54; gap min 0.152, default 0.152
via viaSize (default): diameter min 0.5, default 0.61, max 10; hole min 0.3, default 0.305, max 6.3

## Placement (name value [footprint] x y rotation side)
C23  220uF  [CAP-SMD_BD6.3-L6.6-W6.6-FD]  39.34 63.39 180 top
C24  100nF  [C0603]  39.73 68.49 180 top
C26  100nF  [C0805]  47.58 41.79 180 top
C27  220uF  [CAP-SMD_BD6.3-L6.6-W6.6-LS7.6-RD]  39.49 41.88 180 top
C28  100nF  [C0603]  22.92 42.72 270 bottom
D2  SS54  [SMA_L4.3-W2.6-LS5.0-RD]  52.84 52.08 90 bottom
H38  -  [T插公头]  52.68 4.17 270 top
H50  USART1  [HDR-TH_8P-P2.54-V-F-R2-C4-S2.54]  43.97 34.7 180 top
H51  U3  [HDR-TH_4P-P2.54-V-M]  53.95 15.12 270 top
H53  USART3  [HDR-TH_4P-P2.54-V-M]  3.1 28.18 270 top
H56  KH-2.54PH180-1X5P-L11.5  [HDR-TH_5P-P2.54-V-M]  50.02 16.39 270 top
L4  33uH  [IND-SMD_L7.0-W6.6_FXL0630]  49.58 65.08 90 top
LED2  -  [LED_0603]  39.91 6.38 180 top
LED4  -  [LED_0603]  44.17 9.03 180 top
Q3  AO3400  [SOT-23-3_L2.9-W1.3-P1.90-LS2.4-BR]  36.37 40.6 0 bottom
Q4  AO3400  [SOT-23-3_L2.9-W1.3-P1.90-LS2.4-BR]  36.34 53.18 0 bottom
Q5  AO3400  [SOT-23-3_L2.9-W1.3-P1.90-LS2.4-BR]  36.33 65.77 0 bottom
R7  2K  [R0603]  39.86 8.92 180 top
R10  100kΩ  [R0603]  21.05 42.7 90 bottom
R11  75kΩ  [R0603]  22.92 46.27 90 bottom
R12  2kΩ  [R0603]  21.07 46.27 270 bottom
R15  1kΩ  [R0603]  35.4 48.59 90 bottom
R16  10kΩ  [R0603]  37.34 48.59 90 bottom
R17  1kΩ  [R0603]  35.41 35.69 90 bottom
R18  10kΩ  [R0603]  37.37 35.69 90 bottom
R19  1kΩ  [R0603]  35.41 60.76 90 bottom
R20  10kΩ  [R0603]  37.33 60.75 90 bottom
R21  1kΩ  [R0603]  44.17 6.38 180 top
RJ1  高巨摇杆电位器3D13A1N-T-386  [RES-ADJ-TH_3D13A1N-T-386]  13.49 27.77 270 top
SCREW1  -  [M3螺丝]  24.59 69.2 0 top
SCREW2  -  [M3螺丝]  6.56 36.04 0 top
SCREW3  -  [M3螺丝]  52.47 28.75 0 top
U2  PZ254V-11-04P  [HDR-TH_4P-P2.54-V-M]  57.94 15.12 270 top
U8  LM2596S-5.0/TR  [TO-263-5_L10.2-W8.6-P1.70-LS14.4-TL]  43.94 52.37 180 top
U14  左  [HDR-TH_30P-P2.54-V-F-R2-C15-S2.54-2]  31.27 51.41 270 top
U15  右  [HDR-TH_30P-P2.54-V-F-R2-C15-S2.54-2]  56.67 51.41 270 top
U21  SS-12D01-G5  [SW-TH_DEALON_SS-12D01-GX]  41.13 2.4 0 top
U23  WAFER-PH2.0-2PWZ  [CONN-TH_2P-P2.00_GP01-2001WR-2P]  26.9 44.89 90 top
U24  WAFER-PH2.0-2PWZ  [CONN-TH_2P-P2.00_GP01-2001WR-2P]  26.9 52.54 90 top
U25  WAFER-PH2.0-2PWZ  [CONN-TH_2P-P2.00_GP01-2001WR-2P]  26.9 60.49 90 top
U26  -  [四PinU型按键]  29.87 4.45 180 top
USART1  -  [ATK-LORA]  35.44 21.6 180 bottom
USART3  PZ254V-11-04P  [HDR-TH_4P-P2.54-V-M]  44.66 73.57 0 top

## Footprints (pads in the part's own frame, mm; a bottom-side part is the same pattern mirrored in y, then rotated)
ATK-LORA
  rect 0.9x2.6 smd: 1(11.532,-7.992) 2(9.532,-7.992) 3(7.532,-7.992) 4(0.999,-7.992) 5(-1.001,-7.992) 6(-3.001,-7.992) 7(-5.001,-7.992) 8(-7.001,-7.992) 9(-9.001,-7.992) 10(-9.001,8.576) 11(-7.001,8.576) 12(-5.001,8.576) 13(-3.001,8.576) 14(-1.001,8.576) 15(0.999,8.576)
C0603
  rect 0.8x0.9 smd: 1(-0.7,0) 2(0.7,0)
C0805
  rect 1.41x1.35 smd: 1(-1,0) 2(1,0)
CAP-SMD_BD6.3-L6.6-W6.6-FD
  rect 3.5x1.2 smd: 1(-2.67,0) 2(2.67,0)
CAP-SMD_BD6.3-L6.6-W6.6-LS7.6-RD
  rect 3.5x1.2 smd: 1(-2.67,0) 2(2.67,0)
CONN-TH_2P-P2.00_GP01-2001WR-2P
  rect 1.524x1.524 hole 0.914: 1(-1,0)
  round 1.524 hole 0.914: 2(1,0)
HDR-TH_4P-P2.54-V-M
  rect 1.7x1.7 hole 1.1: 1(-3.81,0)
  round 1.7 hole 1.1: 2(-1.27,0) 3(1.27,0) 4(3.81,0)
HDR-TH_5P-P2.54-V-M
  rect 1.7x1.7 hole 1.1: 1(-5.08,0)
  round 1.7 hole 1.1: 2(-2.54,0) 3(0,0) 4(2.54,0) 5(5.08,0)
HDR-TH_8P-P2.54-V-F-R2-C4-S2.54
  rect 1.6x1.6 hole 1.1: 1(-3.81,-1.27)
  round 1.6 hole 1.1: 2(-3.81,1.27) 3(-1.27,-1.27) 4(-1.27,1.27) 5(1.27,-1.27) 6(1.27,1.27) 7(3.81,-1.27) 8(3.81,1.27)
HDR-TH_30P-P2.54-V-F-R2-C15-S2.54-2
  rect 1.7x1.7 hole 1.02: 1(-17.78,-1.27)
  round 1.7 hole 1.02: 2(-17.78,1.27) 3(-15.24,-1.27) 4(-15.24,1.27) 5(-12.7,-1.27) 6(-12.7,1.27) 7(-10.16,-1.27) 8(-10.16,1.27) 9(-7.62,-1.27) 10(-7.62,1.27) 11(-5.08,-1.27) 12(-5.08,1.27) 13(-2.54,-1.27) 14(-2.54,1.27) 15(0,-1.27) 16(0,1.27) 17(2.54,-1.27) 18(2.54,1.27) 19(5.08,-1.27) 20(5.08,1.27) 21(7.62,-1.27) 22(7.62,1.27) 23(10.16,-1.27) 24(10.16,1.27) 25(12.7,-1.27) 26(12.7,1.27) 27(15.24,-1.27) 28(15.24,1.27) 29(17.78,-1.27) 30(17.78,1.27)
IND-SMD_L7.0-W6.6_FXL0630
  rect 2.424x3.62 smd: 1(3.302,0) 2(-3.302,0)
LED_0603
  rect 0.8x0.8 smd: 1(-0.851,-0.01) 2(0.75,-0.005)
M3螺丝
  round 3.2 hole 3.2: 1(-0.064,0.064)
R0603
  rect 0.806x0.864 smd: 1(-0.753,0) 2(0.753,0)
RES-ADJ-TH_3D13A1N-T-386
  round 2 hole 1.5: 0(-3.575,7.2) 0(-3.575,-5.3) 0(7.125,7.2) 0(7.125,-5.3)
  round 1.6 hole 1: 1(10.125,3.45) 2(10.125,0.95) 3(10.125,-1.55) 4(4.275,-7.2) 5(1.775,-7.2) 6(-0.725,-7.2) 7(-10.125,4.15) 8(-10.125,-2.25) 9(-5.625,4.15) 10(-5.625,-2.25)
SMA_L4.3-W2.6-LS5.0-RD
  rect 2.046x1.62 smd: 1(-2.404,-0.009) 2(2.404,0.009)
SOT-23-3_L2.9-W1.3-P1.90-LS2.4-BR
  rect 1.25x0.7 smd: 1(1,-0.95) 2(1,0.95) 3(-1,0)
SW-TH_DEALON_SS-12D01-GX
  round 1.524 hole 0.914: 1(-2.5,0) 2(0,0) 3(2.5,0)
TO-263-5_L10.2-W8.6-P1.70-LS14.4-TL
  rect 3.4x1.1 smd: 1(-4.953,3.4) 2(-4.953,1.7) 3(-4.953,0) 4(-4.953,-1.7) 5(-4.953,-3.4)
  rect 8.705x10.587 smd: 6(4.953,0)
T插公头
  rect 2.5x5.5 hole 1.8x4.8: 1(-0.635,3.302)
  rect 5.5x2.5 hole 4.8x1.8: 2(0,-2.54)
四PinU型按键
  rect 1x1.524 smd: 1(-2,0) 2(0,0) 3(2,0) 4(4,0)
  oval 1.524x3.048 smd: 5(-4,2) 6(6,2)

## Nets
3V3: H50.8 RJ1.1 RJ1.4 U15.11 U15.12 U15.27 U15.29
5V: C23.1 C24.1 H50.7 H51.1 H53.1 H56.5 L4.1 R7.1 U2.1 U8.4 U14.26 U14.28 U14.30 USART1.7 USART1.8
7.6V: C26.2 C27.1 R10.1 R21.1 U8.1 U21.2 U23.1 U24.1 U25.1 USART3.1
+7.6V: H38.2 U21.3
GND: C23.2 C24.2 C26.1 C27.2 C28.2 H38.1 H50.5 H51.2 H53.3 H56.2 LED2.1 LED4.1 Q3.2 Q4.2 Q5.2 R12.2 R16.1 R18.1 R20.1 RJ1.3 RJ1.6 RJ1.9 U2.2 U8.6 U14.25 U14.27 U14.29 U15.13 U15.14 U15.26 U15.28 U15.30 U26.2 USART1.1 USART1.3 USART1.9 USART1.15 USART3.4
BAT: U15.25
BOOT: U15.3
CLK: H50.1 H53.4
DIO: H50.3 H53.2
MDO: H56.1 USART1.6
PA0: U14.6 USART3.3
PA1: U14.5 USART3.2
PA2: U2.4 U14.8
PA3: U2.3 U14.7
PA4: U14.10
PA5: U14.12
PA6: U14.14
PA7: U14.16
PA8: U15.17
PA11: U15.20
PA12: U15.19
PA15: U15.18
PB0: U14.13 U26.4
PB1: U14.15 U26.3
PB2: U14.17 U26.1
PB3: U15.8
PB4: U15.7
PB5: U15.6
PB6: U15.5
PB7: U15.4
PB9: U15.2
PB10: H51.4 U14.19
PB11: H51.3 U14.20
PB12: C28.1 R10.2 R11.1 U14.21
PB13: U14.22
PB14: U14.23
PB15: U14.24
PC0: U14.2
PC1: RJ1.5 U14.1
PC2: RJ1.2 U14.4
PC3: RJ1.7 U14.3
PC4: U14.18
PC5: U14.11
PC6: U15.23
PC7: R19.1 U15.24
PC8: R15.1 U15.21
PC9: R17.1 U15.22
PC10: U15.16
PC11: U15.15
PC12: U15.10
PC13: U15.1
PD2: U15.9
RST: H50.6
RX_PA10: H50.4 H56.3 USART1.11
TX_PA9: H50.2 H56.4 USART1.10
VREF: U14.9
$1N385: D2.2 U8.3 U8.5
$1N386: D2.1 L4.2 U8.2
$1N392: LED2.2 R7.2
$1N13221: R11.2 R12.1
$1N31586: Q4.1 R15.2 R16.2
$1N32984: Q3.1 R17.2 R18.2
$1N33166: Q5.1 R19.2 R20.2
$1N36354: LED4.2 R21.2
$1N39133: Q3.3 U23.2
$1N39187: Q4.3 U24.2
$1N39241: Q5.3 U25.2

Pads without a net: RJ1 0 8 10; SCREW1 1; SCREW2 1; SCREW3 1; U21 1; U26 5 6; USART1 2 4 5 12 13 14

## Via types
v1: diameter 0.61, hole 0.305, Top Layer to Bottom Layer, 41 vias

## Routing (per net, layer and track width the routed paths; a pad name or vN(x,y) marks a point on that pad's centre or on a via; arc(x,y) is an arc through that point)
3V3: length 104.2
  Top Layer w1.27: 16.98,15.99 8.54,15.99 6.29,18.23 RJ1.4 ; 16.98,15.99 16.94,16.03 RJ1.1 ; 16.98,15.99 21.05,15.99 23.13,18.07 37.88,18.07 40.16,20.35 H50.8
  Bottom Layer w0.508: H50.8 41.4,34.67 55.4,34.67
  Bottom Layer w1.27: U15.12 U15.11 54.96,56.93 52,56.93 50.78,55.71 50.78,40.79 55.4,36.17 U15.29
5V: length 236.4
  Top Layer w1.27: v1(42.01,59.52) C23.1 42.13,63.52 42.13,68.49 ; 50.09,8.98 55.05,8.98 56.11,10.04 56.11,18.93 ; 50.09,8.98 48.49,8.98 46.16,11.3 41.55,11.3 40.61,10.36 R7.1 42.05,7.49 42.05,5.82 42.07,5.8 42.07,5.01 41.13,4.07 v1(35.61,4.07) ; 50.09,8.98 50.02,9.05 H56.5 ; C24.1 42.13,68.49 ; 42.13,68.49 49.48,68.49 L4.1 51.38,68.39 52.84,66.93 52.84,60 51.64,58.81 47.58,58.81 46.41,57.64 46.41,54.9 46.99,54.31 48.65,54.31 48.89,54.07 ; U2.1 H51.1 ; H50.7 40.16,37.65 39.14,38.67 32.58,38.67 U14.26
  Bottom Layer w1.27: v1(42.32,11.44) 40.44,13.32 USART1.7 40.75,13.91 40.75,26.12 ; H50.7 40.14,35.99 40.14,37.86 42.01,39.73 v1(42.01,59.52) ; U14.26 U14.30 32.54,28.41 34.57,26.37 50.5,26.37 U2.1 ; 2.95,32.32 4.02,33.38 9.02,33.38 9.02,33.37 10.72,31.67 10.72,19.67 9.82,18.76 9.82,16.97 10.72,16.06 16.34,16.06 21.06,11.34 21.06,5.52 24.06,2.52 34.07,2.52 v1(35.61,4.07)
7.6V: length 155
  Top Layer w0.508: v1(27.2,39.99) 39.88,39.99 41.74,41.84
  Top Layer w0.762: R21.1 v1(44.92,7.58)
  Top Layer w1.27: C27.1 42.25,41.79 C26.2 46.54,41.75 46.54,40.04 47.8,38.78 51.37,38.78 52.81,40.22 52.81,48.14 51.98,48.97 U8.1
  Bottom Layer w0.508: R10.1 21.05,38.1 21.75,37.4 24.85,37.4 24.87,37.37 ; v1(27.2,39.99) 24.87,39.99
  Bottom Layer w0.762: v1(44.92,7.58) 41.18,7.58 41.13,7.64
  Bottom Layer w1.27: 24.85,51.64 24.95,51.54 26.6,51.54 ; 24.85,51.64 24.85,45.25 24.87,45.22 24.87,43.83 ; 24.85,51.64 24.85,59.49 ; 24.87,43.83 26.33,43.83 26.39,43.89 ; 24.87,43.83 24.87,32.04 32.67,24.24 32.67,12.38 34.67,10.37 40.06,10.37 41.13,9.31 U21.2 ; USART3.1 39.12,71.84 29.75,71.84 28.36,70.46 28.36,67.89 24.85,64.37 24.85,59.49 ; 24.85,59.49 24.85,59.49 U25.1
+7.6V: length 7.3
  Bottom Layer w1.27: U21.3 44.9,3.67 49.64,3.67 H38.2
GND: length 59.2
  Top Layer w0.381: C24.2 38.93,68.59 v1(37.72,68.59) ; v1(33.35,44.89) 36.37,41.88 C27.2 ; v1(48.8,43.82) 48.8,42.01 C26.1 ; LED2.1 39.43,5.06 35.41,5.06 v1(34.55,5.93) ; v1(39.48,64.31) 38.56,63.39 C23.2 ; U8.6 v1(38.99,58.84) ; v1(46.11,9.25) 45.89,9.04 45.01,9.04 ; U26.2 29.87,1.56 v1(29.75,1.43)
  Bottom Layer w0.381: USART1.1 23.91,15.22 v1(24.5,15.82) 24.74,16.06 27.26,16.06 27.91,15.41 USART1.3 ; R20.1 37.33,60 38.56,60 38.99,59.58 v1(38.99,58.84) ; R12.2 19.68,45.52 v1(16.79,42.63) ; USART1.9 v1(44.44,15.96) ; R18.1 v1(38.14,35.71) 38.14,36.99 37.37,37.76 Q3.2 ; v1(39.48,64.31) 38.96,64.82 Q5.2 ; C28.2 22.92,39.19 v1(23.6,38.52)
(no net): length 34.7
  Bottom Layer w0.254: 27.09,7.27 29.95,7.27 29.95,9.46 32.49,9.46 32.49,7.3 35.03,7.3 35.03,9.43 37.32,9.43 37.32,7.3 39.6,7.3 ; 27.09,7.27 25.1,7.27 25.07,7.3 25.07,12.2 25.91,13.03 USART1.2 ; 27.09,7.27 27.09,12.18
CLK: length 63.2
  Top Layer w0.381: H50.1 46.49,34.68 39.73,34.68 38.48,33.44 38.48,21.8 36.55,19.87 23.63,19.87 22.2,18.45 18.93,18.45 17.5,19.87 v1(17.5,21.8)
  Inner1 w0.381: v1(17.5,21.8) 17.02,22.28 4.78,22.28 2.37,24.7
DIO: length 83
  Top Layer w0.381: v1(20.04,14.61) 21.57,14.61 23.5,16.54 39.53,16.54 41.43,18.44 45.92,18.44 47.2,19.73 47.2,29.07 48.98,30.84 48.98,36.86 48.46,37.37 46.64,37.37 H50.3
  Inner1 w0.381: 2.37,29.78 0.79,28.2 0.79,21.07 5.87,15.99 18.67,15.99 v1(20.04,14.61)
MDO: length 17.9
  Top Layer w0.381: v1(38.46,13.62) 47.43,13.62 48.24,14.43 48.24,19.69 H56.1
  Bottom Layer w0.381: USART1.6 38.44,13.61 v1(38.46,13.62)
PA0: length 21.5
  Top Layer w0.381: USART3.3 45.93,70.95 45.14,70.16 35.46,70.16 34.67,69.38 34.67,64.86 33.93,64.11 32.54,64.11
PA1: length 20.7
  Top Layer w0.381: USART3.2 43.36,73.54 43.36,71.61 42.7,70.95 35.06,70.95 34.01,69.91 34.01,66.07 33.28,65.34 31.23,65.34 30,64.11
PA2: length 76.3
  Inner1 w0.381: U2.4 57.94,11.74 59.49,13.29 59.49,26.17 58.88,26.78 36.07,26.78 34.67,28.18 34.67,60.94 34.05,61.57 U14.8
PA3: length 108.2
  Inner1 w0.381: U2.3 57.41,13.85 56.06,12.5 53.37,12.5 52.45,11.59 52.45,8.22 51.68,7.45 48.68,7.45 46.29,5.06 26.9,5.06 22.3,9.66 22.3,35.11 17.53,39.89 17.53,43.42 21.21,47.1 21.21,61.5 22.3,62.59 28.98,62.59 30,61.57
PB0: length 54
  Top Layer w0.381: U26.4 25.8,4.53 24.44,4.53 23.83,5.14 v1(23.83,9.56)
  Inner1 w0.381: v1(23.83,9.56) 23.45,9.94 23.45,17.43 28.17,22.16 v1(28.17,41.11)
  Bottom Layer w0.381: v1(28.17,41.11) 28.17,52.12 30,53.95
PB1: length 55.7
  Top Layer w0.381: U26.3 27.87,5.51 27.44,5.95 v1(24.97,5.95) ; v1(24.41,22.31) 24.41,49.26 25.4,50.25 28.84,50.25 30,51.41
  Bottom Layer w0.381: v1(24.97,5.95) 24.97,6.08 22.76,8.29 22.76,21.01 24.06,22.31 v1(24.41,22.31)
PB2: length 65.1
  Top Layer w0.381: 30,48.87 26.54,48.87 25.48,47.81 v1(25.48,23.17) ; v1(26.88,4) 26.88,1.21 27.49,0.59 30.89,0.59 31.86,1.56 31.86,4.44 U26.1
  Bottom Layer w0.381: v1(26.88,4) 25.79,4 22.1,7.68 22.1,21.5 23.78,23.17 v1(25.48,23.17)
PB10: length 114.2
  Top Layer w0.381: v1(21.21,19.21) 23.07,21.07 24.31,21.07 26.14,22.89 26.14,36.76 26.85,37.47 v1(34.01,37.47)
  Inner1 w0.381: H51.4 53.95,8.31 52.23,6.59 52.23,1.33 51.66,0.76 28.52,0.76 21.21,8.06 v1(21.21,19.21)
  Bottom Layer w0.381: 30,46.33 31.25,47.58 33.38,47.58 38.89,42.07 38.89,33.51 38.28,32.9 34.65,32.9 34.01,33.54 v1(34.01,37.47)
PB11: length 59.3
  Inner1 w0.381: 32.54,46.33 31.22,45.01 31.22,19.54 40.06,10.7 42.47,10.7 43.42,9.75 43.42,8.87 43.81,8.49 50.83,8.49 51.74,9.41 51.74,12.61 52.89,13.75 53.85,13.75 H51.3
PB12: length 19.7
  Top Layer w0.381: 18.8,43.44 18.75,43.39 v1(18.75,43.42)
  Inner1 w0.381: v1(18.75,43.42) 18.75,42.3 19.18,41.87 28.08,41.87 30,43.79
  Bottom Layer w0.381: R10.2 21.01,43.42 v1(18.75,43.42)
  Bottom Layer w1.27: R11.1 22.92,45.52 C28.1 22.9,43.45 R10.2
PC1: length 61
  Top Layer w0.508: RJ1.5 10.45,26 12.53,28.08 12.53,39.05 13.57,40.09 20.88,40.09 22.23,41.44 22.23,63.53 27.88,69.19 30,69.19
PC2: length 64.4
  Top Layer w0.508: RJ1.2 14.41,17.68 14.41,38.06 15.57,39.23 21.39,39.23 22.94,40.78 22.94,62.98 27.87,67.91 31.28,67.91 U14.4
PC3: length 37.3
  Top Layer w0.508: 30,66.65 27.88,66.65 23.75,62.52 23.75,40.06 21.51,37.82 17.84,37.82
PC7: length 39.8
  Inner1 w0.381: 57.94,41.25 56.65,42.54 36.62,42.54 35.41,43.75 v1(35.41,58.91)
  Bottom Layer w0.381: v1(35.41,58.91) 35.41,58.92 35.41,60.01
PC8: length 21.7
  Inner1 w0.381: v1(37.31,45.93) 53.26,45.93 U15.21
  Bottom Layer w0.381: v1(37.31,45.93) R15.1
PC9: length 38.8
  Inner1 w0.381: v1(35.44,33.64) 35.44,32.41 36.24,31.61 58.27,31.61 59.24,32.57 59.24,42.49 U15.22
  Bottom Layer w0.381: v1(35.44,33.64) 35.41,33.66 R17.1
RX_PA10: length 26.1
  Top Layer w0.381: v1(42.5,19.69) 42.44,19.75 v1(42.44,30.18)
  Inner1 w0.381: v1(42.5,19.69) 42.5,17.58 43.47,16.61 49.07,16.61 49.77,15.91 50.17,15.91
  Bottom Layer w0.381: H50.4 43.95,32.14 42.78,32.14 42.44,31.8 v1(42.44,30.18)
TX_PA9: length 29.2
  Top Layer w0.381: v1(44.43,19.92) 44.44,19.93 v1(44.44,30.18)
  Inner1 w0.381: H56.4 50.73,13.85 51.77,14.89 51.77,17.03 51.06,17.74 46.61,17.74 v1(44.43,19.92)
  Bottom Layer w0.381: v1(44.44,30.18) 44.44,31.67 44.89,32.11 47.43,32.11 47.78,32.47 H50.2
$1N385: length 9.9
  Top Layer w1.27: U8.3 51.47,52.37 52.77,53.68 52.84,53.68 v1(52.84,54.34) 52.84,54.8 51.95,55.69 48.98,55.69 48.89,55.77
$1N386: length 24.6
  Top Layer w1.27: v1(52.84,51.8) 51.71,50.67 U8.2 46.27,50.67 44.94,52 44.94,60.26 46.23,61.55 49.36,61.55 L4.2
  Bottom Layer w1.27: v1(52.84,51.8) 52.84,49.68 D2.1
$1N392: length 2.6
  Top Layer w1.27: R7.2 39.16,8.87 LED2.2
$1N13221: length 1.9
  Bottom Layer w1.27: R12.1 R11.2
$1N31586: length 7.2
  Bottom Layer w0.381: R16.2 37.34,49.34 36.33,49.34 ; R15.2 36.33,49.34 ; 36.33,49.34 36.33,53.13 Q4.1
$1N32984: length 7.5
  Bottom Layer w0.381: Q3.1 36.34,40.52 36.34,36.5 36.28,36.44 ; 36.28,36.44 R18.2 ; 36.28,36.44 R17.2
$1N33166: length 7.5
  Bottom Layer w0.381: 36.38,61.52 36.36,61.54 36.36,65.75 Q5.1 ; 36.38,61.52 37.32,61.52 ; 36.38,61.52 R19.2 ; R20.2 37.33,61.51 ; 37.33,61.51 37.32,61.52 ; 37.33,61.51 37.33,61.51
$1N36354: length 2.5
  Top Layer w1.27: 43.42,6.39 43.42,6.39 43.42,8.87 43.45,8.9
$1N39133: length 12.5
  Top Layer w0.381: 26.39,45.89 26.51,46.01 27.66,46.01 28.25,45.42 28.25,43.32 28.97,42.6 33.36,42.6 v1(33.89,42.07)
  Bottom Layer w0.381: 35.37,40.6 35.36,40.6 v1(33.89,42.07)
$1N39187: length 9.3
  Top Layer w0.381: v1(33.91,53.15) 33.42,53.15 32.94,52.66 28.6,52.66 27.74,53.53 26.61,53.53 26.6,53.54
  Bottom Layer w0.381: Q4.3 35.3,53.15 v1(33.91,53.15)
$1N39241: length 12.1
  Bottom Layer w0.381: Q5.3 33.73,65.77 33.43,65.46 33.04,65.46 33.03,65.46 27.71,65.46 26.93,64.68 26.93,61.51 U25.2

## Copper pours and planes (outline as drawn; the poured copper is in the pictures)
5V on Bottom Layer: 39.5,15.35 43.34,15.35 43.34,11.96 39.5,11.96
GND on Top Layer: -3.91,89.93 64.16,89.93 64.16,-19.02 -3.91,-19.02
GND on Bottom Layer: -9.04,86.57 77.19,86.57 77.19,-15.79 -9.04,-15.79
GND on Inner2: -19.99,81.7 74.22,81.7 74.22,-11.06 -19.99,-11.06

Small or netless copper shapes (teardrops, artwork), in the pictures only: 68 on Top Layer, 90 on Bottom Layer, 26 on Inner1

## Text on the board
Top Silkscreen Layer: U1 | Handle V5.0 / Designed by Point / 2024/11/17 | PB0~PB2 | 5V | 7.6V | Ana | adc | DIO | CLK | Z Y X | T | R | - | + | M | 0 | 1 | LORA调试 | 陀螺仪
